# Altium schematic sheet Analog_readout1.SchDoc
size A4
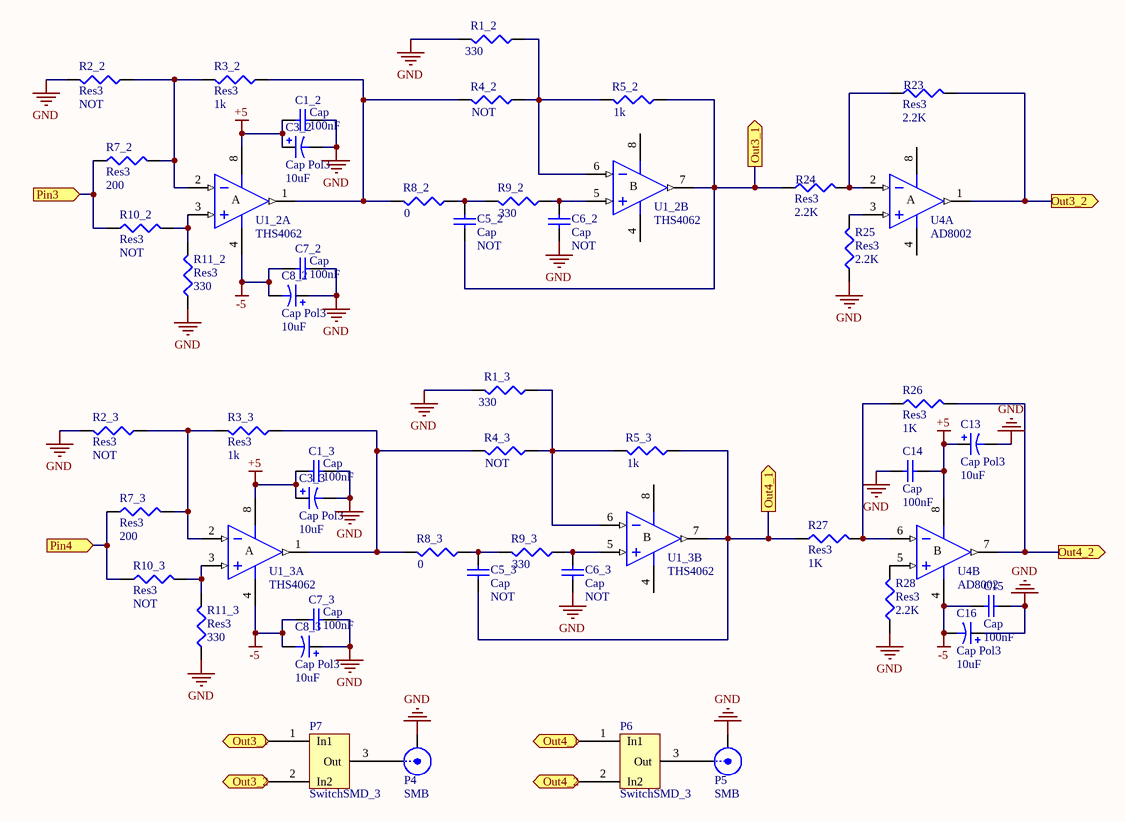
[diagram p0: Analog_readout1.SchDoc]

## Parts
C1_2  Cap  value 100nF  [6-0805_N]
C1_3  Cap  value 100nF  [6-0805_N]
C3_2  Cap Pol3  value 10uF  [6-0805_N]
C3_3  Cap Pol3  value 10uF  [6-0805_N]
C5_2  Cap  value NOT  [6-0805_N]
C5_3  Cap  value NOT  [6-0805_N]
C6_2  Cap  value NOT  [6-0805_N]
C6_3  Cap  value NOT  [6-0805_N]
C7_2  Cap  value 100nF  [6-0805_N]
C7_3  Cap  value 100nF  [6-0805_N]
C8_2  Cap Pol3  value 10uF  [6-0805_N]
C8_3  Cap Pol3  value 10uF  [6-0805_N]
C13  Cap Pol3  value 10uF  [6-0805_N]
C14  Cap  value 100nF  [6-0805_N]
C15  Cap  value 100nF  [6-0805_N]
C16  Cap Pol3  value 10uF  [6-0805_N]
P4  SMB  [SMB_V-RJ45]
P5  SMB  [SMB_V-RJ45]
P6  SwitchSMD_3  [SwitchSMD_0603]
P7  SwitchSMD_3  [SwitchSMD_0603]
R1_2  value 330  [6-0805_N]  (hidden comment: Res3)
R1_3  value 330  [6-0805_N]  (hidden comment: Res3)
R2_2  Res3  value NOT  [6-0805_N]
R2_3  Res3  value NOT  [6-0805_N]
R3_2  Res3  value 1k  [6-0805_N]
R3_3  Res3  value 1k  [6-0805_N]
R4_2  value NOT  [6-0805_N]  (hidden comment: Res3)
R4_3  value NOT  [6-0805_N]  (hidden comment: Res3)
R5_2  value 1k  [6-0805_N]  (hidden comment: Res3)
R5_3  value 1k  [6-0805_N]  (hidden comment: Res3)
R7_2  Res3  value 200  [6-0805_N]
R7_3  Res3  value 200  [6-0805_N]
R8_2  value 0  [6-0805_N]  (hidden comment: Res3)
R8_3  value 0  [6-0805_N]  (hidden comment: Res3)
R9_2  value 330  [6-0805_N]  (hidden comment: Res3)
R9_3  value 330  [6-0805_N]  (hidden comment: Res3)
R10_2  Res3  value NOT  [6-0805_N]
R10_3  Res3  value NOT  [6-0805_N]
R11_2  Res3  value 330  [6-0805_N]
R11_3  Res3  value 330  [6-0805_N]
R23  Res3  value 2.2K  [6-0805_N]
R24  Res3  value 2.2K  [6-0805_N]
R25  Res3  value 2.2K  [6-0805_N]
R26  Res3  value 1K  [6-0805_N]
R27  Res3  value 1K  [6-0805_N]
R28  Res3  value 2.2K  [6-0805_N]
U1_2  THS4062  [SO-8_M]  (parts A,B of 2)
U1_3  THS4062  [SO-8_M]  (parts A,B of 2)
U4  AD8002  [SO-8_M]  (parts A,B of 2)

## Ports
Out3_1 (out), Out3_2 (out), Out4_1 (out), Out4_2 (out), Pin3 (in), Pin4 (in)

## Nets
+5: C1_2.2 C1_3.2 C3_2.1 C3_3.1 C13.1 C14.2 U1_2.8(V+) U1_3.8(V+) U4.8(V+)
-5: C7_2.2 C7_3.2 C8_2.2 C8_3.2 C15.1 C16.2 U1_2.4(V-) U1_3.4(V-) U4.4(V-)
GND: C1_2.1 C1_3.1 C3_2.2 C3_3.2 C6_2.2 C6_3.2 C7_2.1 C7_3.1 C8_2.1 C8_3.1 C13.2 C14.1 C15.2 C16.1 P4.2(Y) P5.2(Y) R1_2.2 R1_3.2 R2_2.2 R2_3.2 R11_2.1 R11_3.1 R25.1 R28.1
Out3_1: C5_2.2 P7.1(In1) R5_2.1 R24.1 U1_2.7(OUT) ; port Out3_1
Out3_2: P7.2(In2) R23.2 U4.1(OUT) ; port Out3_2
Out4_1: C5_3.2 P6.1(In1) R5_3.1 R27.1 U1_3.7(OUT) ; port Out4_1
Out4_2: P6.2(In2) R26.2 U4.7(OUT) ; port Out4_2
Pin3: R7_2.1 R10_2.1 ; port Pin3
Pin4: R7_3.1 R10_3.1 ; port Pin4
NetC5_2_1: C5_2.1 R8_2.1 R9_2.2
NetC5_3_1: C5_3.1 R8_3.1 R9_3.2
NetC6_2_1: C6_2.1 R9_2.1 U1_2.5(IN+)
NetC6_3_1: C6_3.1 R9_3.1 U1_3.5(IN+)
NetP4_1: P4.1(X) P7.3(Out)
NetP5_1: P5.1(X) P6.3(Out)
NetR1_2_1: R1_2.1 R4_2.1 R5_2.2 U1_2.6(IN-)
NetR1_3_1: R1_3.1 R4_3.1 R5_3.2 U1_3.6(IN-)
NetR2_2_1: R2_2.1 R3_2.2 R7_2.2 U1_2.2(IN-)
NetR2_3_1: R2_3.1 R3_3.2 R7_3.2 U1_3.2(IN-)
NetR3_2_1: R3_2.1 R4_2.2 R8_2.2 U1_2.1(OUT)
NetR3_3_1: R3_3.1 R4_3.2 R8_3.2 U1_3.1(OUT)
NetR10_2_2: R10_2.2 R11_2.2 U1_2.3(IN+)
NetR10_3_2: R10_3.2 R11_3.2 U1_3.3(IN+)
NetR23_1: R23.1 R24.2 U4.2(IN-)
NetR25_2: R25.2 U4.3(IN+)
NetR26_1: R26.1 R27.2 U4.6(IN-)
NetR28_2: R28.2 U4.5(IN+)

## Notes on the sheet
- (in symbol AD8002AR, part A) A
- (in symbol AD8002AR, part B) B

## Library data of the parts
C1_2 C1_3 C5_2 C5_3 C6_2 C6_3 C7_2 C7_3 C14 C15 = Cap: Capacitor; Published: 8-Jun-2000; LatestRevisionDate: 17-Jul-2002; LatestRevisionNote: Re-released for DXP Platform.; PackageReference: RAD-0.3; Publisher: Altium Limited; PackageDescription: Radial Cap, Thru-Hole; 2 Leads; 0.3 in Pin Spacing
C3_2 C3_3 C8_2 C8_3 C13 C16 = Cap Pol3: Polarized Capacitor (Surface Mount); Published: 8-Jun-2000; LatestRevisionDate: 29-May-2009; LatestRevisionNote: IPC-7351 Footprint Added.; PackageReference: C0805; Publisher: Altium Limited; PackageDescription: Chip Capacitor
P4 P5 = SMB: SMB Straight Connector; LatestRevisionDate: 17-Jul-2002; LatestRevisionNote: Re-released for DXP Platform.; Publisher: Altium Limited
R1_2 R1_3 R2_2 R2_3 R3_2 R3_3 R4_2 R4_3 R5_2 R5_3 R7_2 R7_3 R8_2 R8_3 R9_2 R9_3 R10_2 R10_3 R11_2 R11_3 R23-R28 = Res3: Resistor; Published: 8-Jun-2000; LatestRevisionDate: 29-May-2009; LatestRevisionNote: IPC-7351 Footprint Added.; PackageReference: J1-0603; Publisher: Altium Limited; PackageDescription: Chip Resistor
U1_2 U1_3 U4 = AD8002AR: Dual 600MHz, 50mW Current Feedback Amplifier; Published: 8-Jun-2000; LatestRevisionDate: 13-Apr-2006; LatestRevisionNote: IPC-7351 Footprint Added.; DatasheetVersion: REV. C 1999; PackageVersion: revA; PackageReference: SO-8; Publisher: Altium Limited; PackageDescription: 8-Pin Small Outline Integrated Circuit 1.27 mm Pitch; Code_JEDEC: MS-012-AA; Code_IPC: SOIC127P600-8; ComponentLink1Description: Manufacturer Link; ComponentLink1URL: http://www.analog.com/en/prod/0,,759_786_AD8002%2C00.html; ComponentLink2Description: Datasheet; ComponentLink2URL: http://www.analog.com/UploadedFiles/Data_Sheets/147523773AD8002_d.pdf